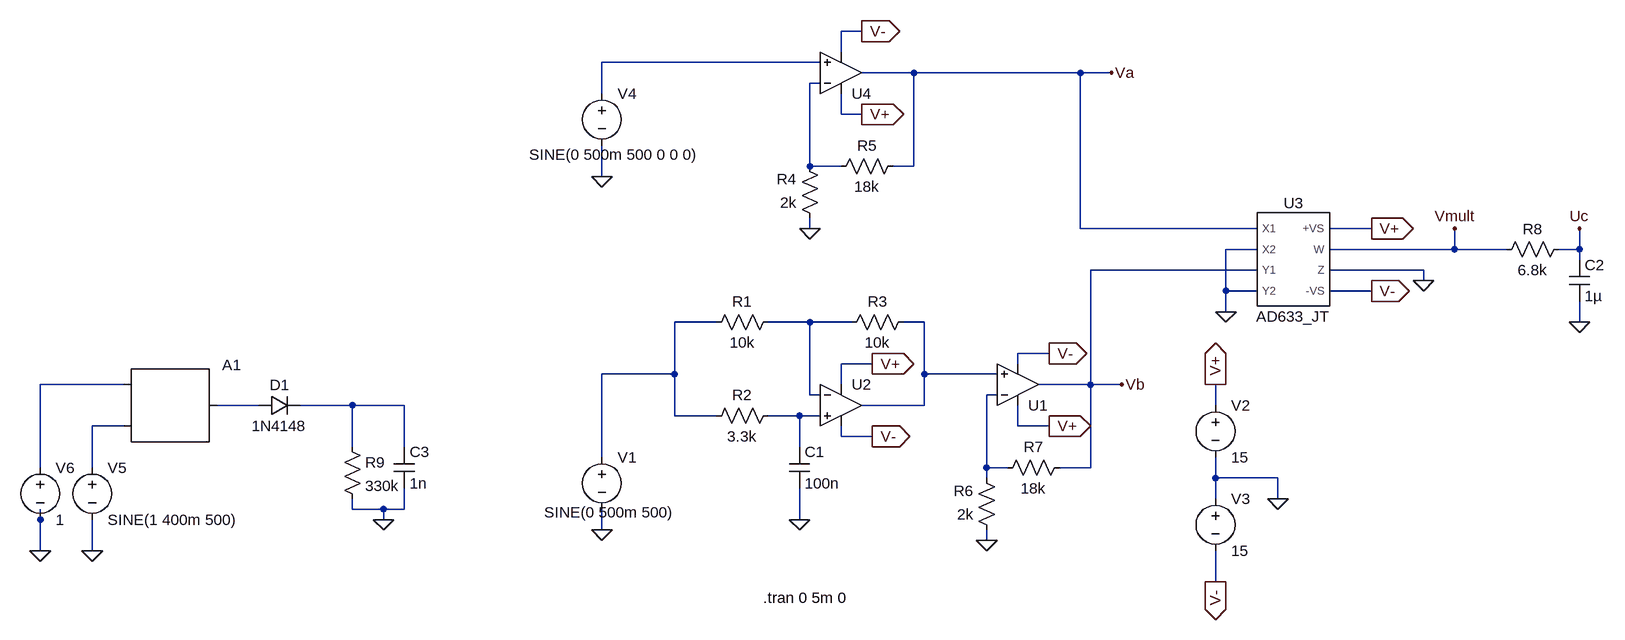
[diagram p0: schematic Draft4.asc]
Draft4.asc, the LTspice schematic file:
Version 4
SHEET 1 1684 680
WIRE 160 -688 128 -688
WIRE 128 -656 128 -688
WIRE 96 -640 -240 -640
WIRE 240 -624 160 -624
WIRE 496 -624 240 -624
WIRE 544 -624 496 -624
WIRE 96 -608 80 -608
WIRE -240 -592 -240 -640
WIRE 128 -560 128 -592
WIRE 160 -560 128 -560
WIRE 80 -480 80 -608
WIRE 128 -480 80 -480
WIRE 240 -480 240 -624
WIRE 240 -480 208 -480
WIRE -240 -464 -240 -512
WIRE 80 -384 80 -400
WIRE 496 -384 496 -624
WIRE 768 -384 496 -384
WIRE 944 -384 880 -384
WIRE 768 -352 720 -352
WIRE 1072 -352 1072 -384
WIRE 1072 -352 880 -352
WIRE 1152 -352 1072 -352
WIRE 1264 -352 1264 -384
WIRE 1264 -352 1232 -352
WIRE 1264 -336 1264 -352
WIRE 768 -320 512 -320
WIRE 1024 -320 880 -320
WIRE 1024 -304 1024 -320
WIRE 720 -288 720 -352
WIRE 768 -288 720 -288
WIRE 944 -288 880 -288
WIRE 720 -256 720 -288
WIRE -64 -240 -128 -240
WIRE 80 -240 16 -240
WIRE 144 -240 80 -240
WIRE 256 -240 224 -240
WIRE 1264 -240 1264 -272
WIRE 448 -192 400 -192
WIRE 176 -176 128 -176
WIRE 400 -176 400 -192
WIRE -128 -160 -128 -240
WIRE -128 -160 -240 -160
WIRE 256 -160 256 -240
WIRE 368 -160 256 -160
WIRE -976 -144 -1104 -144
WIRE 128 -144 128 -176
WIRE 512 -144 512 -320
WIRE 512 -144 432 -144
WIRE 560 -144 512 -144
WIRE 80 -128 80 -240
WIRE 96 -128 80 -128
WIRE 368 -128 352 -128
WIRE -768 -112 -832 -112
WIRE -624 -112 -704 -112
WIRE -544 -112 -624 -112
WIRE 256 -112 256 -160
WIRE 256 -112 160 -112
WIRE 704 -112 704 -144
WIRE -128 -96 -128 -160
WIRE -64 -96 -128 -96
WIRE 64 -96 16 -96
WIRE 96 -96 64 -96
WIRE -976 -80 -1024 -80
WIRE 400 -80 400 -112
WIRE 448 -80 400 -80
WIRE 128 -64 128 -80
WIRE 176 -64 128 -64
WIRE -624 -48 -624 -112
WIRE -544 -48 -544 -112
WIRE 64 -48 64 -96
WIRE -240 -32 -240 -160
WIRE -1104 -16 -1104 -144
WIRE -1024 -16 -1024 -80
WIRE 352 -16 352 -128
WIRE 384 -16 352 -16
WIRE 512 -16 512 -144
WIRE 512 -16 464 -16
WIRE 352 0 352 -16
WIRE 704 0 704 -32
WIRE 800 0 704 0
WIRE 704 32 704 0
WIRE 800 32 800 0
WIRE -624 48 -624 32
WIRE -576 48 -624 48
WIRE -544 48 -544 16
WIRE -544 48 -576 48
WIRE -1104 64 -1104 48
WIRE -576 64 -576 48
WIRE 64 64 64 16
WIRE -240 80 -240 48
WIRE 352 96 352 80
WIRE -1104 112 -1104 64
WIRE -1024 112 -1024 64
WIRE 704 160 704 112
FLAG 64 64 0
FLAG 80 -384 0
FLAG 352 96 0
FLAG -240 80 0
FLAG 448 -80 V+
IOPIN 448 -80 Out
FLAG 160 -560 V+
IOPIN 160 -560 Out
FLAG 176 -176 V+
IOPIN 176 -176 Out
FLAG 704 -144 V+
IOPIN 704 -144 Out
FLAG 800 32 0
FLAG 704 160 V-
IOPIN 704 160 Out
FLAG 160 -688 V-
IOPIN 160 -688 Out
FLAG 176 -64 V-
IOPIN 176 -64 Out
FLAG 448 -192 V-
IOPIN 448 -192 Out
FLAG -240 -464 0
FLAG 944 -384 V+
IOPIN 944 -384 Out
FLAG 944 -288 V-
IOPIN 944 -288 Out
FLAG 1024 -304 0
FLAG 720 -256 0
FLAG 1264 -240 0
FLAG -576 64 0
FLAG -1104 112 0
FLAG -1024 112 0
FLAG 1072 -384 Vmult
FLAG 544 -624 Va
FLAG 560 -144 Vb
FLAG 1264 -384 Uc
SYMBOL res 32 -256 R90
WINDOW 0 0 56 VBottom 2
WINDOW 3 32 56 VTop 2
SYMATTR InstName R1
SYMATTR Value 10k
SYMBOL res 32 -112 R90
WINDOW 0 0 56 VBottom 2
WINDOW 3 32 56 VTop 2
SYMATTR InstName R2
SYMATTR Value 3.3k
SYMBOL res 240 -256 R90
WINDOW 0 0 56 VBottom 2
WINDOW 3 32 56 VTop 2
SYMATTR InstName R3
SYMATTR Value 10k
SYMBOL cap 48 -48 R0
SYMATTR InstName C1
SYMATTR Value 100n
SYMBOL res 96 -384 R180
WINDOW 0 36 76 Left 2
WINDOW 3 36 40 Left 2
SYMATTR InstName R4
SYMATTR Value 2k
SYMBOL res 112 -464 R270
WINDOW 0 32 56 VTop 2
WINDOW 3 0 56 VBottom 2
SYMATTR InstName R5
SYMATTR Value 18k
SYMBOL res 368 96 R180
WINDOW 0 36 76 Left 2
WINDOW 3 36 40 Left 2
SYMATTR InstName R6
SYMATTR Value 2k
SYMBOL res 368 0 R270
WINDOW 0 32 56 VTop 2
WINDOW 3 0 56 VBottom 2
SYMATTR InstName R7
SYMATTR Value 18k
SYMBOL voltage -240 -48 R0
WINDOW 123 0 0 Left 2
WINDOW 39 0 0 Left 2
WINDOW 3 -89 101 Left 2
SYMATTR InstName V1
SYMATTR Value SINE(0 500m 500)
SYMBOL Opamps\\UniversalOpamp2 128 -624 M180
SYMATTR InstName U4
SYMBOL Opamps\\UniversalOpamp2 400 -144 M180
SYMATTR InstName U1
SYMBOL Opamps\\UniversalOpamp2 128 -112 R0
SYMATTR InstName U2
SYMBOL voltage 704 -128 R0
WINDOW 123 0 0 Left 2
WINDOW 39 0 0 Left 2
SYMATTR InstName V2
SYMATTR Value 15
SYMBOL voltage 704 16 R0
WINDOW 123 0 0 Left 2
WINDOW 39 0 0 Left 2
SYMATTR InstName V3
SYMATTR Value 15
SYMBOL voltage -240 -608 R0
WINDOW 123 0 0 Left 2
WINDOW 39 0 0 Left 2
WINDOW 3 -112 110 Left 2
SYMATTR InstName V4
SYMATTR Value SINE(0 500m 500 0 0 0)
SYMBOL AD633_JT 816 -336 R0
SYMATTR InstName U3
SYMBOL res 1248 -368 R90
WINDOW 0 0 56 VBottom 2
WINDOW 3 32 56 VTop 2
SYMATTR InstName R8
SYMATTR Value 6.8k
SYMBOL cap 1248 -336 R0
SYMATTR InstName C2
SYMATTR Value 1µ
SYMBOL res -640 -64 R0
SYMATTR InstName R9
SYMATTR Value 330k
SYMBOL cap -560 -48 R0
SYMATTR InstName C3
SYMATTR Value 1n
SYMBOL diode -768 -96 R270
WINDOW 0 32 32 VTop 2
WINDOW 3 0 32 VBottom 2
SYMATTR InstName D1
SYMATTR Value 1N4148
SYMBOL SpecialFunctions\\modulate -976 -144 R0
WINDOW 3 0 0 Invisible 2
SYMATTR InstName A1
SYMATTR Value space=40k
SYMATTR Value2 mark=40k
SYMBOL voltage -1024 -32 R0
WINDOW 123 0 0 Left 2
WINDOW 39 0 0 Left 2
SYMATTR InstName V5
SYMATTR Value SINE(1 400m 500)
SYMBOL voltage -1104 -32 R0
WINDOW 123 0 0 Left 2
WINDOW 39 0 0 Left 2
SYMATTR InstName V6
SYMATTR Value 1
TEXT 8 184 Left 2 !.tran 0 5m 0

The netlist it stands for:
* Draft4.asc
R1 N004 N003 10k
R2 N010 N003 3.3k
R3 N005 N004 10k
C1 N010 0 100n
R4 0 N002 2k
R5 N002 Va 18k
R6 0 N007 2k
R7 N007 Vb 18k
V1 N003 0 SINE(0 500m 500)
XU4 N001 N002 V+ V- Va level.2 Avol=1Meg GBW=10Meg Slew=10Meg ilimit=25m rail=0 Vos=0 phimargin=45 en=0 enk=0 in=0 ink=0 Rin=500Meg  ; pins IN+ IN- V+ V- OUT
XU1 N005 N007 V+ V- Vb level.2 Avol=1Meg GBW=10Meg Slew=10Meg ilimit=25m rail=0 Vos=0 phimargin=45 en=0 enk=0 in=0 ink=0 Rin=500Meg  ; pins IN+ IN- V+ V- OUT
XU2 N010 N004 V+ V- N005 level.2 Avol=1Meg GBW=10Meg Slew=10Meg ilimit=25m rail=0 Vos=0 phimargin=45 en=0 enk=0 in=0 ink=0 Rin=500Meg  ; pins IN+ IN- V+ V- OUT
V2 V+ 0 15
V3 0 V- 15
V4 N001 0 SINE(0 500m 500 0 0 0)
XU3 Va 0 Vb 0 V- 0 Vmult V+ AD633_JT  ; pins X1 X2 Y1 Y2 -VS Z W +VS
R8 Uc Vmult 6.8k
C2 Uc 0 1µ
R9 N009 0 330k
C3 N009 0 1n
D1 N008 N009 1N4148
A1 N006 N011 0 0 0 0 N008 0 MODULATOR space=40k mark=40k
V5 N011 0 SINE(1 400m 500)
V6 N006 0 1
.model D D
.lib standard.dio
.tran 0 5m 0
.lib UniversalOpamps2.sub
.lib AD633_JT.lib
.backanno
.end